# Altium schematic sheet EVALUE.SchDoc: VCVS - Value
size A; DocumentNumber: 1; SheetNumber: 1; SheetTotal: 1
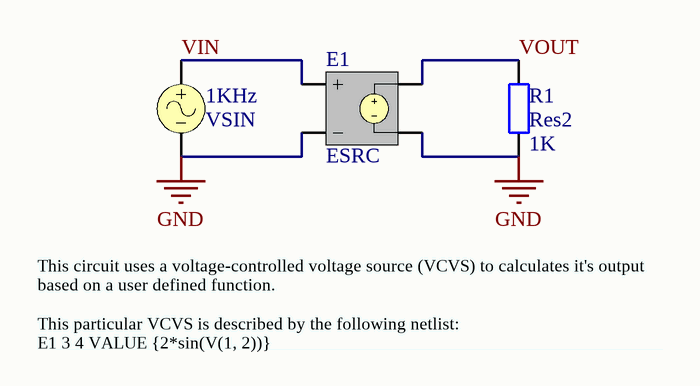
[diagram p0: EVALUE.SchDoc]

## Parts
1KHz  VSIN
E1  ESRC
R1  Res2  value 1K  [AXIAL-0.4]

## Nets
GND: 1KHz.2 E1.2(NC-) E1.4(N-) R1.1
VIN: 1KHz.1 E1.1(NC+)
VOUT: E1.3(N+) R1.2

## Notes on the sheet
- This circuit uses a voltage-controlled voltage source (VCVS) to calculates it's output based on a user defined function.
  This particular VCVS is described by the following netlist:
  E1 3 4 VALUE {2*sin(V(1, 2))}
- Title
- Size:
- Date:
- A
- Number:
- Time:
- Revision:
- Sheet
- of
- File:

## Library data of the parts
1KHz = VSIN: Sinusoidal Voltage Source; Note: PCB Footprint - Not required; Published: 8-Jun-2000; LatestRevisionDate: 15-Nov-2004; LatestRevisionNote: Corrected Netlist.; PackageReference: Not Applicable; Publisher: Altium Limited
E1 = ESRC: Voltage Controlled Voltage Source; Note: PCB Footprint - Not required; Sim Note: Enter gain into gain field; Published: 8-Jun-2000; LatestRevisionDate: 17-Jul-2002; LatestRevisionNote: Re-released for DXP Platform.; PackageReference: Not Applicable; Publisher: Altium Limited
R1 = Res2: Resistor; Published: 8-Jun-2000; LatestRevisionDate: 17-Jul-2002; LatestRevisionNote: Re-released for DXP Platform.; Publisher: Altium Limited